# Altium schematic sheet Audio Power Supply.SchDoc
size A3; Date: 27.05.2014; DrawnBy: luths8; Organization: BFH; Address1: Bern University of Applied Sciences; Address2: Engineering and Information Technology; Address3: Jlcoweg 1; Address4: CH-3400 Burgdorf; DocumentNumber: 1; Revision: 1.0; SheetNumber: 2; SheetTotal: 17; CurrentDate: 27.05.2014
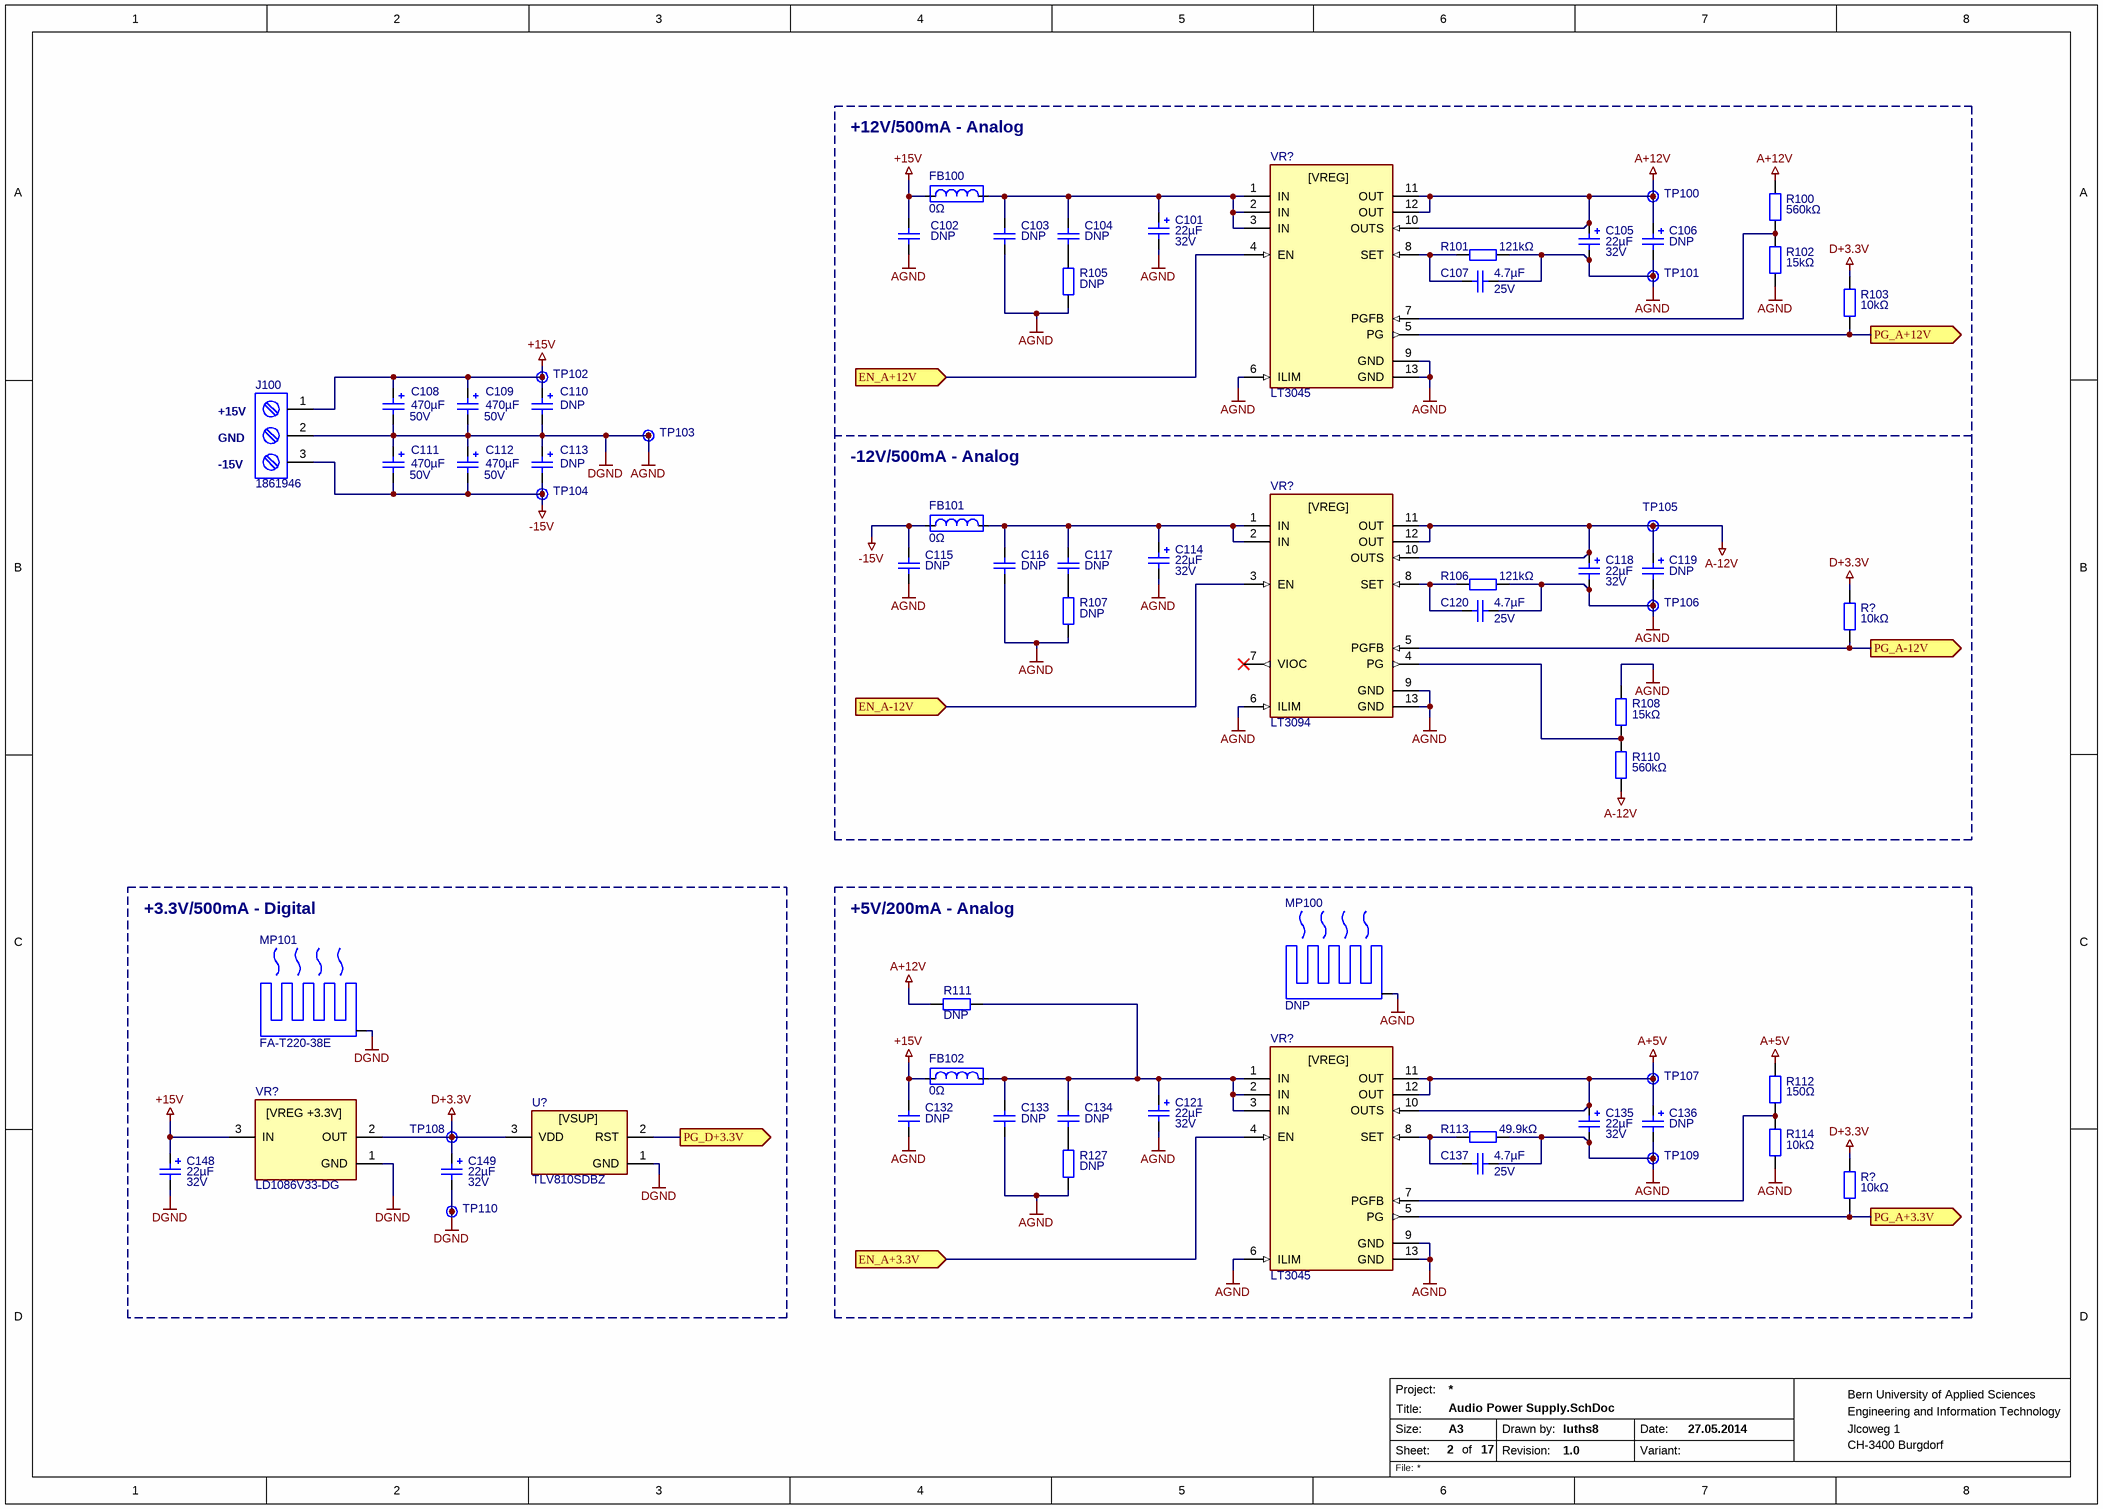
[diagram p0: Audio Power Supply.SchDoc]

## Parts
(Parts that share a designator on the sheet are numbered #1, #2 ... from top to bottom, then left to right.)
C101  22µF  Voltage: 32V  [CAP-6.3-5.5-2.5]
C102  DNP  [SMD0805CAP]
C103  DNP  [SMD0805CAP]
C104  DNP  [SMD0805CAP]
C105  22µF  Voltage: 32V  [CAP-6.3-5.5-2.5]
C106  DNP  [CAP-6.3-5.5-2.5]
C107  4.7µF  Voltage: 25V  [SMD1206CAP]
C108  470µF  Voltage: 50V  [CAP-12.5-20-5]
C109  470µF  Voltage: 50V  [CAP-12.5-20-5]
C110  DNP  [CAP-12.5-20-5]
C111  470µF  Voltage: 50V  [CAP-12.5-20-5]
C112  470µF  Voltage: 50V  [CAP-12.5-20-5]
C113  DNP  [CAP-12.5-20-5]
C114  22µF  Voltage: 32V  [CAP-6.3-5.5-2.5]
C115  DNP  [SMD0805CAP]
C116  DNP  [SMD0805CAP]
C117  DNP  [SMD0805CAP]
C118  22µF  Voltage: 32V  [CAP-6.3-5.5-2.5]
C119  DNP  [CAP-6.3-5.5-2.5]
C120  4.7µF  Voltage: 25V  [SMD1206CAP]
C121  22µF  Voltage: 32V  [CAP-6.3-5.5-2.5]
C132  DNP  [SMD0805CAP]
C133  DNP  [SMD0805CAP]
C134  DNP  [SMD0805CAP]
C135  22µF  Voltage: 32V  [CAP-6.3-5.5-2.5]
C136  DNP  [CAP-6.3-5.5-2.5]
C137  4.7µF  Voltage: 25V  [SMD1206CAP]
C148  22µF  Voltage: 32V  [CAP-6.3-5.5-2.5]
C149  22µF  Voltage: 32V  [CAP-6.3-5.5-2.5]
FB100  0Ω  [SMD0603RES]
FB101  0Ω  [SMD0603RES]
FB102  0Ω  [SMD0603RES]
J100  1861946  [1861946]
MP100  DNP  [DA-T263-201E]
MP101  FA-T220-38E  [FA-T220-38E]
R100  560kΩ  [SMD0603RES]
R101  121kΩ  [SMD0603RES]
R102  15kΩ  [SMD0603RES]
R103  10kΩ  [SMD0603RES]
R105  DNP  [SMD0603RES]
R106  121kΩ  [SMD0603RES]
R107  DNP  [SMD0603RES]
R108  15kΩ  [SMD0603RES]
R110  560kΩ  [SMD0603RES]
R111  DNP  [SMD0603RES]
R112  150Ω  [SMD0603RES]
R113  49.9kΩ  [SMD0603RES]
R114  10kΩ  [SMD0603RES]
R127  DNP  [SMD0603RES]
R?#1  10kΩ  [SMD0603RES]
R?#2  10kΩ  [SMD0603RES]
TP100  Testpoint  [TP]  (value not drawn)  (no BOM)
TP101  Testpoint  [TP]  (value not drawn)  (no BOM)
TP102  Testpoint  [TP]  (value not drawn)  (no BOM)
TP103  Testpoint  [TP]  (value not drawn)  (no BOM)
TP104  Testpoint  [TP]  (value not drawn)  (no BOM)
TP105  Testpoint  [TP]  (value not drawn)  (no BOM)
TP106  Testpoint  [TP]  (value not drawn)  (no BOM)
TP107  Testpoint  [TP]  (value not drawn)  (no BOM)
TP108  Testpoint  [TP]  (value not drawn)  (no BOM)
TP109  Testpoint  [TP]  (value not drawn)  (no BOM)
TP110  Testpoint  [TP]  (value not drawn)  (no BOM)
U?  TLV810SDBZ  [SOT-23]
VR?#1  LT3045  [MSOP12]
VR?#2  LT3094  [MSOP12]
VR?#3  LT3045  [MSOP12]
VR?#4  LD1086V33-DG  [TO220-3]

## Blocks framed on the sheet
+12V/500mA - Analog: C101-C107 FB100 R100-R103 R105 TP100 TP101 VR?#1
+3.3V/500mA - Digital: C148 C149 MP101 TP108 TP110 U? VR?#4
+5V/200mA - Analog: C121 C132-C137 FB102 MP100 R111-R114 R127 R?#2 TP107 TP109 VR?#3

## Ports
EN_A+3.3V (in), EN_A+12V (in), EN_A-12V (in), PG_A+3.3V (out), PG_A+12V (out), PG_A-12V (out), PG_D+3.3V (out)

## Nets
+15V: C102.2(q) C108.P C109.P C110.P C132.2(q) C148.P FB100.1 FB102.1 J100.1 TP102.1 VR?#4.3(IN)
-15V: C111.M(q) C112.M(q) C113.M(q) C115.2(q) FB101.1 J100.3 TP104.1
A+5V: C135.P C136.P R112.2 TP107.1 VR?#3.10(OUTS) VR?#3.11(OUT) VR?#3.12(OUT)
A+12V: C105.P C106.P R100.2 R111.1 TP100.1 VR?#1.10(OUTS) VR?#1.11(OUT) VR?#1.12(OUT)
A-12V: C118.P C119.P R110.2 TP105.1 VR?#2.10(OUTS) VR?#2.11(OUT) VR?#2.12(OUT)
AGND: C101.M(q) C102.1 C103.1 C105.M(q) C106.M(q) C107.2(q) C108.M(q) C109.M(q) C110.M(q) C111.P C112.P C113.P C114.M(q) C115.1 C116.1 C118.M(q) C119.M(q) C120.2(q) C121.M(q) C132.1 C133.1 C135.M(q) C136.M(q) C137.2(q) C148.M(q) C149.M(q) J100.2 MP100.0 MP101.0 R101.2 R102.1 R105.1 R106.2 R107.1 R108.1 R113.2 R114.1 R127.1 TP101.1 TP103.1 TP106.1 TP109.1 TP110.1 U?.1(GND) VR?#1.6(ILIM) VR?#1.9(GND) VR?#1.13(GND) VR?#2.6(ILIM) VR?#2.9(GND) VR?#2.13(GND) VR?#3.6(ILIM) VR?#3.9(GND) VR?#3.13(GND) VR?#4.1(GND)  [also labelled DGND]
D+3.3V: C149.P R103.2 R?#1.2 R?#2.2 TP108.1 U?.3(VDD) VR?#4.2(OUT)
EN_A+3.3V: VR?#3.4(EN) ; port EN_A+3.3V
EN_A+12V: VR?#1.4(EN) ; port EN_A+12V
EN_A-12V: VR?#2.3(EN) ; port EN_A-12V
PG_A+3.3V: R?#2.1 VR?#3.5(PG) ; port PG_A+3.3V
PG_A+12V: R103.1 VR?#1.5(PG) ; port PG_A+12V
PG_A-12V: R?#1.1 VR?#2.5(PGFB) ; port PG_A-12V
PG_D+3.3V: U?.2(RST) ; port PG_D+3.3V
NetC101_P: C101.P C103.2(q) C104.2(q) FB100.2 VR?#1.1(IN) VR?#1.2(IN) VR?#1.3(IN)
NetC104_1: C104.1 R105.2
NetC107_1: C107.1 R101.1 VR?#1.8(SET)
NetC114_P: C114.P C116.2(q) C117.2(q) FB101.2 VR?#2.1(IN) VR?#2.2(IN)
NetC117_1: C117.1 R107.2
NetC120_1: C120.1 R106.1 VR?#2.8(SET)
NetC121_P: C121.P C133.2(q) C134.2(q) FB102.2 R111.2 VR?#3.1(IN) VR?#3.2(IN) VR?#3.3(IN)
NetC134_1: C134.1 R127.2
NetC137_1: C137.1 R113.1 VR?#3.8(SET)
NetR100_1: R100.1 R102.2 VR?#1.7(PGFB)
NetR108_2: R108.2 R110.1 VR?#2.4(PG)
NetR112_1: R112.1 R114.2 VR?#3.7(PGFB)

Not connected (* = marked no-connect by the designer): VR?#2 7(VIOC)*

## Notes on the sheet
- (near J100) +15V
- (near J100) GND
- (near J100) -15V
- -12V/500mA - Analog
- Project:
- Size:
- Sheet:
- Title:
- A3
- of
- Drawn by:
- Revision:
- Date:
- Variant:
- File:
- (in symbol LD1086V33-DG) [VREG +3.3V]
- (in symbol LT3045) [VREG]
- (in symbol LT3094) [VREG]
- (in symbol Voltage Supervisor) [VSUP]

## Library data of the parts
C101 C105 C114 C118 C121 C135 C148 C149 = Capacitor Electrolytic: Elektrolytic Capacitor; Manufacturer Part No.: 32SEPF22M
C102-C104 C115-C117 C132-C134 = Capacitor Ceramic: Ceramic Capacitor; Voltage: 25V; Manufacturer Part No.: *
C106 C119 C136 = Capacitor Electrolytic: Elektrolytic Capacitor; Manufacturer Part No.: 32SEPF22M; Voltage: 32V
C107 C120 C137 = Capacitor Ceramic: Ceramic Capacitor; Manufacturer Part No.: *
C108 C109 C111 C112 = Capacitor Electrolytic: Elektrolytic Capacitor; Manufacturer Part No.: EEU-FR1H471
C110 C113 = Capacitor Electrolytic: Elektrolytic Capacitor; Manufacturer Part No.: EEU-FR1H471; Voltage: 50V
FB100-FB102 = Ferrite Bead: Manufacturer Part No.: *
J100 = 1861946: Screw Terminal, 3 Position; Manufacturer Part No.: 1861946
MP100 MP101 = Heatsink
  MP100: Manufacturer Part No.: DA-T263-201E
  MP101: Manufacturer Part No.: FA-T220-38E
R100-R103 R105-R108 R110-R114 R127 R?#1 R?#2 = Resistor: Manufacturer Part No.: *
U? = Voltage Supervisor: Voltage Supervisor, Threshold 2.94V; Manufacturer Part No.: TLV810SDBZR
VR?#1 VR?#3 = LT3045: Linear Regulator, positive Rail, Low Noise, High PSRR; Manufacturer Part No.: LT3045EMSE#PBF
VR?#2 = LT3094: Linear Regulator, negative Rail Low Noise, High PSRR; Manufacturer Part No.: LT3094EMSE#PBF
VR?#4 = LD1086V33-DG: Linear Voltage Regulator, positive Rail; Manufacturer Part No.: LD1086V33-DG
TP100-TP110 = Testpoint: Manufacturer Part No.: *